# Altium project LNA_BFU550.PrjPcb
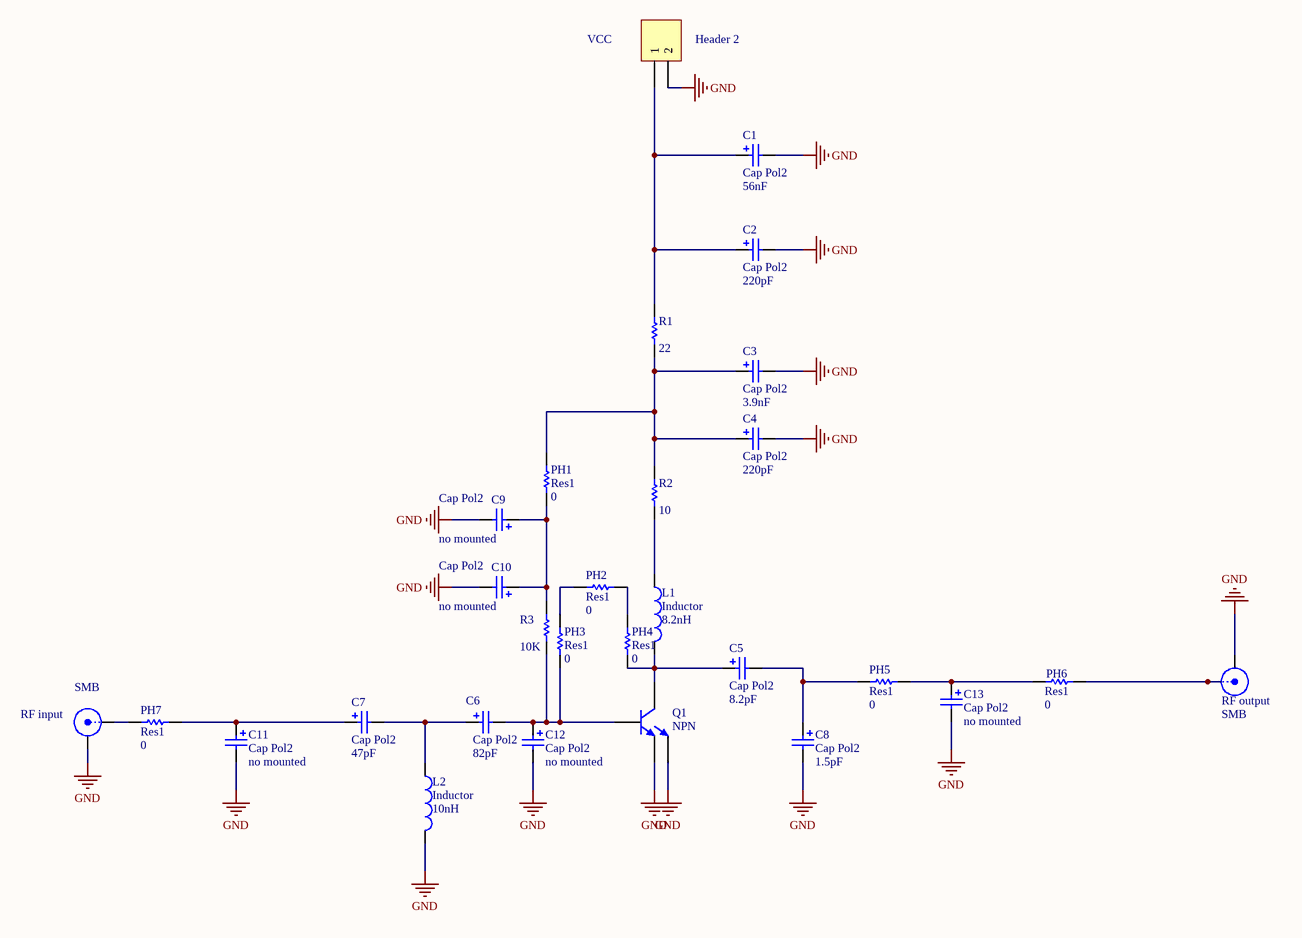
[diagram p0: LNA_BFU500.SchDoc]
1 sheet, 29 parts. Net scope: global (net labels, ports and power ports of the same name join across sheets).
Board file: PCB_LNA_BFU550.PcbDoc

## Sheet LNA_BFU500.SchDoc
size A3; SheetNumber: 1; SheetTotal: 1

### Parts
C1  Cap Pol2  value 56nF  [6-0805_N]
C2  Cap Pol2  value 220pF  [6-0805_N]
C3  Cap Pol2  value 3.9nF  [6-0805_N]
C4  Cap Pol2  value 220pF  [6-0805_N]
C5  Cap Pol2  value 8.2pF  [6-0805_N]
C6  Cap Pol2  value 82pF  [6-0805_N]
C7  Cap Pol2  value 47pF  [6-0805_N]
C8  Cap Pol2  value 1.5pF  [6-0805_N]
C9  Cap Pol2  value no mounted  [6-0805_N]
C10  Cap Pol2  value no mounted  [6-0805_N]
C11  Cap Pol2  value no mounted  [6-0805_N]
C12  Cap Pol2  value no mounted  [6-0805_N]
C13  Cap Pol2  value no mounted  [6-0805_N]
L1  Inductor  value 8.2nH  [6-0805_N]
L2  Inductor  value 10nH  [6-0805_N]
PH1  Res1  value 0  [6-0805_N]
PH2  Res1  value 0  [6-0805_N]
PH3  Res1  value 0  [6-0805_N]
PH4  Res1  value 0  [6-0805_N]
PH5  Res1  value 0  [6-0805_N]
PH6  Res1  value 0  [6-0805_N]
PH7  Res1  value 0  [6-0805_N]
Q1  NPN  [SOT-143_N]
R1  value 22  [6-0805_N]
R2  value 10  [6-0805_N]  (hidden comment: 0)
R3  value 10K  [6-0805_N]  (hidden comment: 0)
RF_input  SMB  [SMA-142-0701-851_V2]
RF_output  SMB  [SMA-142-0701-851_V2]
VCC  Header 2  [HDR1X2]

### Nets
GND: C1.2 C2.2 C3.2 C4.2 C8.2 C9.2 C10.2 C11.2 C12.2 C13.2 L2.2 Q1.3(E) Q1.4(E) RF_input.2(Y) RF_output.2(Y) VCC.2
NetC1_1: C1.1 C2.1 R1.2 VCC.1
NetC3_1: C3.1 C4.1 PH1.2 R1.1 R2.2
NetC5_1: C5.1 L1.2 PH4.1 Q1.1(C)
NetC5_2: C5.2 C8.1 PH5.1
NetC6_1: C6.1 C7.2 L2.1
NetC6_2: C6.2 C12.1 PH3.1 Q1.2(B) R3.1
NetC7_1: C7.1 C11.1 PH7.2
NetC9_1: C9.1 C10.1 PH1.1 R3.2
NetC13_1: C13.1 PH5.2 PH6.1
NetL1_1: L1.1 R2.1
NetPH2_1: PH2.1 PH3.2
NetPH2_2: PH2.2 PH4.2
NetPH6_2: PH6.2 RF_output.1(X)
NetPH7_1: PH7.1 RF_input.1(X)

### Library data of the parts
C1-C8 = Cap Pol2_1: Polarized Capacitor (Axial); Published: 8-Jun-2000; LatestRevisionDate: 17-Jul-2002; LatestRevisionNote: Re-released for DXP Platform.; PackageReference: POLAR0.8; Publisher: Altium Limited; PackageDescription: Polarized Capacitor; 2 Leads
C9-C13 = Cap Pol2_7: Polarized Capacitor (Axial); Published: 8-Jun-2000; LatestRevisionDate: 17-Jul-2002; LatestRevisionNote: Re-released for DXP Platform.; PackageReference: POLAR0.8; Publisher: Altium Limited; PackageDescription: Polarized Capacitor; 2 Leads
L1 L2 = Inductor: Code_IEC: 1005; Published: 8-Jun-2000; LatestRevisionDate: 29-May-2009; LatestRevisionNote: IPC-7351 Footprint Added.; PackageReference: 0402-A; Publisher: Altium Limited; PackageDescription: Chip Inductor; Code_JEITA: 0402
PH1-PH7 = Res1_1: Resistor; Published: 8-Jun-2000; LatestRevisionDate: 17-Jul-2002; LatestRevisionNote: Re-released for DXP Platform.; PackageReference: AXIAL-0.3; Publisher: Altium Limited; PackageDescription: Axial Device, Thru-Hole; 2 Leads; 0.3 in Pin Spacing
Q1 = NPN: NPN Bipolar Transistor; Published: 8-Jun-2000; LatestRevisionDate: 17-Jul-2002; LatestRevisionNote: Re-released for DXP Platform.; PackageReference: TO-226-AA; Publisher: Altium Limited; PackageDescription: TO, Flat Index; 3 In-Line, Axial Leads; Body Dia. 4.8mm; Leads 0.55 x 0.51 mm (max); Code_JEDEC: TO-226-AA
R1-R3 = Res1: Resistor; Published: 8-Jun-2000; LatestRevisionDate: 17-Jul-2002; LatestRevisionNote: Re-released for DXP Platform.; PackageReference: AXIAL-0.3; Publisher: Altium Limited; PackageDescription: Axial Device, Thru-Hole; 2 Leads; 0.3 in Pin Spacing
RF_input RF_output = SMB: SMB Straight Connector; LatestRevisionDate: 17-Jul-2002; LatestRevisionNote: Re-released for DXP Platform.; Publisher: Altium Limited
VCC = Header 2: Header, 2-Pin; LatestRevisionDate: 17-Jul-2002; LatestRevisionNote: Re-released for DXP Platform.; Publisher: Altium Limited